# Altium schematic sheet [00]-esp32_dht11.SchDoc
size A4; SheetNumber: 1; SheetTotal: 6
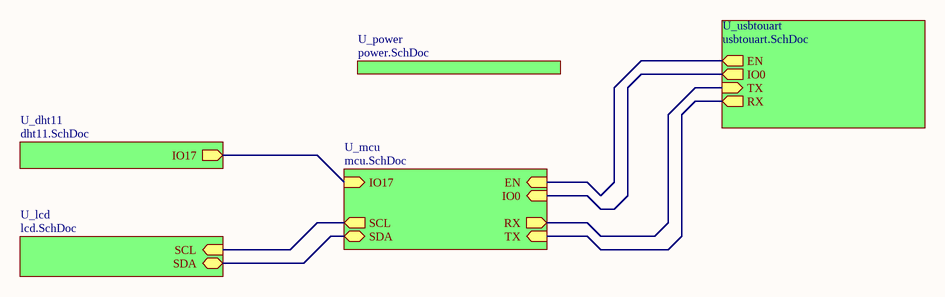
[diagram p0: [00]-esp32_dht11.SchDoc]

## Sub-sheets
U_dht11 = dht11.SchDoc: IO17 (out)
U_lcd = lcd.SchDoc: SCL (in), SDA (bidir)
U_mcu = mcu.SchDoc: EN (in), IO0 (in), IO17 (in), SCL (out), SDA (bidir), TX (in), RX (out)
U_power = power.SchDoc: no entries
U_usbtouart = usbtouart.SchDoc: EN (out), IO0 (out), RX (out), TX (in)

## Nets
(unnamed): sheet U_dht11/IO17, sheet U_mcu/IO17
(unnamed): sheet U_lcd/SCL, sheet U_mcu/SCL
(unnamed): sheet U_lcd/SDA, sheet U_mcu/SDA
(unnamed): sheet U_mcu/EN, sheet U_usbtouart/EN
(unnamed): sheet U_mcu/IO0, sheet U_usbtouart/IO0
(unnamed): sheet U_mcu/TX, sheet U_usbtouart/RX
(unnamed): sheet U_mcu/RX, sheet U_usbtouart/TX